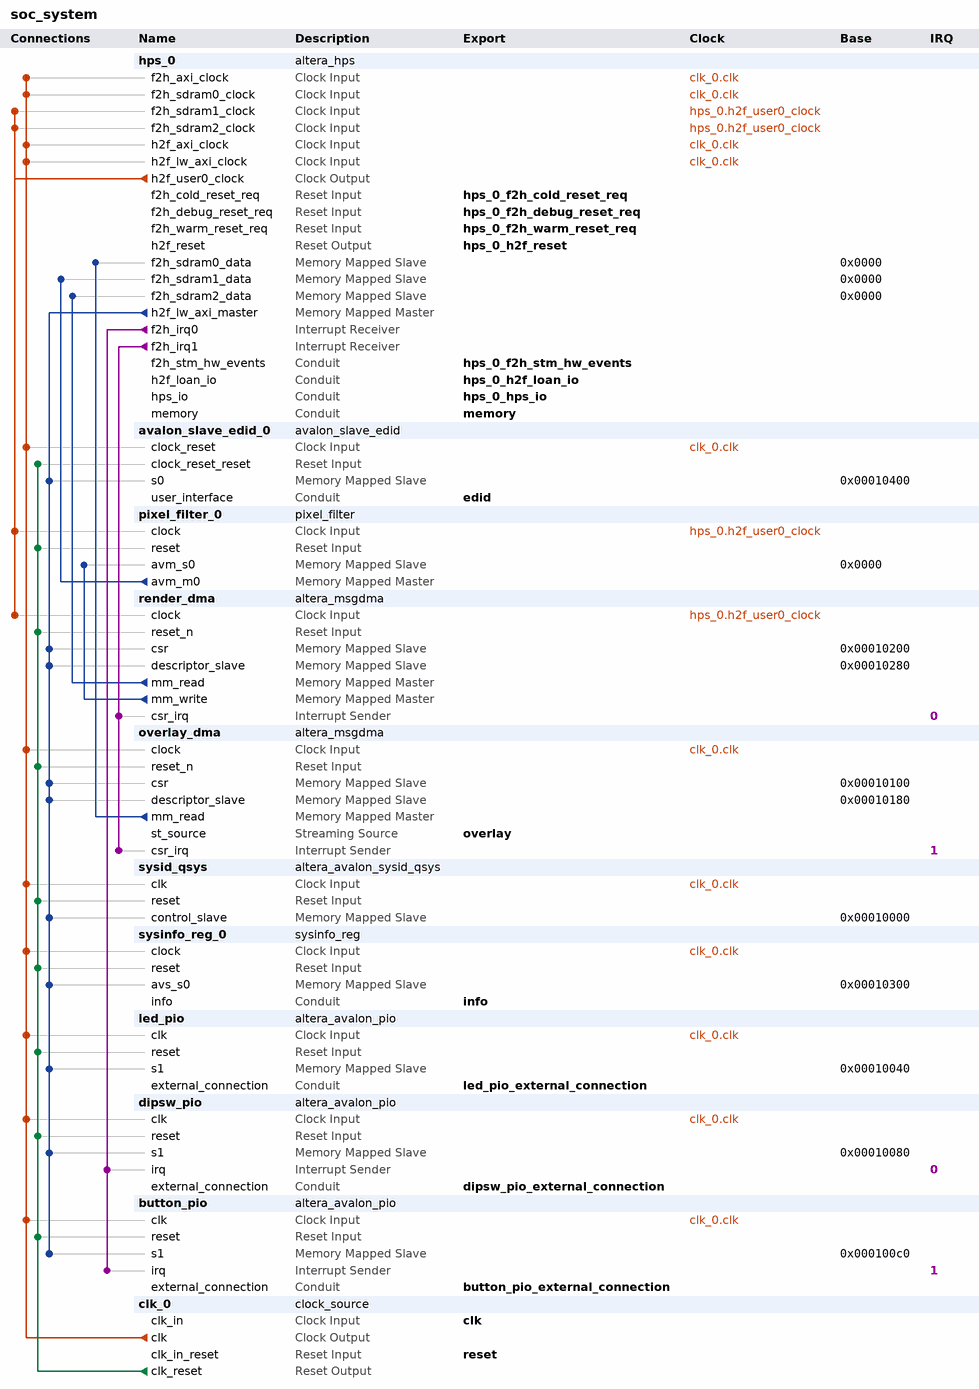
[diagram p0: system contents]
# Platform Designer (Qsys) system soc_system, Cyclone V 5CSEMA5F31C6
# Parameters at their usual value, and those the tool derives, are not listed.
package require -exact qsys 15.1
create_system soc_system
set_project_property DEVICE_FAMILY {Cyclone V}
set_project_property DEVICE 5CSEMA5F31C6

add_instance hps_0 altera_hps 15.1
set_instance_parameter_value hps_0 EMAC1_Mode RGMII
set_instance_parameter_value hps_0 EMAC1_PinMuxing {HPS I/O Set 0}
set_instance_parameter_value hps_0 F2SCLK_COLDRST_Enable true
set_instance_parameter_value hps_0 F2SCLK_DBGRST_Enable true
set_instance_parameter_value hps_0 F2SCLK_WARMRST_Enable true
set_instance_parameter_value hps_0 F2SDRAM_Type {Avalon-MM Read-Only,Avalon-MM Write-Only,Avalon-MM Read-Only}
set_instance_parameter_value hps_0 F2SDRAM_Width 64,64,64
set_instance_parameter_value hps_0 F2SINTERRUPT_Enable true
set_instance_parameter_value hps_0 F2S_Width 2
set_instance_parameter_value hps_0 FPGA_PERIPHERAL_OUTPUT_CLOCK_FREQ_EMAC0_GTX_CLK 100
set_instance_parameter_value hps_0 FPGA_PERIPHERAL_OUTPUT_CLOCK_FREQ_EMAC0_MD_CLK 100.0
set_instance_parameter_value hps_0 FPGA_PERIPHERAL_OUTPUT_CLOCK_FREQ_EMAC1_GTX_CLK 100
set_instance_parameter_value hps_0 FPGA_PERIPHERAL_OUTPUT_CLOCK_FREQ_EMAC1_MD_CLK 100.0
set_instance_parameter_value hps_0 HPS_PROTOCOL DDR3
set_instance_parameter_value hps_0 I2C0_Mode I2C
set_instance_parameter_value hps_0 I2C0_PinMuxing {HPS I/O Set 0}
set_instance_parameter_value hps_0 I2C1_Mode I2C
set_instance_parameter_value hps_0 I2C1_PinMuxing {HPS I/O Set 0}
set_instance_parameter_value hps_0 LWH2F_Enable true
set_instance_parameter_value hps_0 MEM_BANKADDR_WIDTH 3
set_instance_parameter_value hps_0 MEM_CLK_FREQ 400.0
set_instance_parameter_value hps_0 MEM_COL_ADDR_WIDTH 10
set_instance_parameter_value hps_0 MEM_DQ_WIDTH 32
set_instance_parameter_value hps_0 MEM_DRV_STR RZQ/6
set_instance_parameter_value hps_0 MEM_ROW_ADDR_WIDTH 15
set_instance_parameter_value hps_0 MEM_RTT_NOM RZQ/6
set_instance_parameter_value hps_0 MEM_RTT_WR {Dynamic ODT off}
set_instance_parameter_value hps_0 MEM_TCL 7
set_instance_parameter_value hps_0 MEM_TFAW_NS 45.0
set_instance_parameter_value hps_0 MEM_TRAS_NS 36.0
set_instance_parameter_value hps_0 MEM_TRCD_NS 13.125
set_instance_parameter_value hps_0 MEM_TRFC_NS 300.0
set_instance_parameter_value hps_0 MEM_TRP_NS 13.125
set_instance_parameter_value hps_0 MEM_VENDOR Micron
set_instance_parameter_value hps_0 MEM_WTCL 7
set_instance_parameter_value hps_0 QSPI_Mode {1 SS}
set_instance_parameter_value hps_0 QSPI_PinMuxing {HPS I/O Set 0}
set_instance_parameter_value hps_0 REF_CLK_FREQ 25.0
set_instance_parameter_value hps_0 S2FCLK_USER0CLK_Enable true
set_instance_parameter_value hps_0 S2FCLK_USER2CLK 1
set_instance_parameter_value hps_0 S2F_Width 3
set_instance_parameter_value hps_0 SDIO_Mode {4-bit Data}
set_instance_parameter_value hps_0 SDIO_PinMuxing {HPS I/O Set 0}
set_instance_parameter_value hps_0 SPIM1_Mode {Single Slave Select}
set_instance_parameter_value hps_0 SPIM1_PinMuxing {HPS I/O Set 0}
set_instance_parameter_value hps_0 STM_Enable true
set_instance_parameter_value hps_0 TIMING_BOARD_AC_SKEW 0.02
set_instance_parameter_value hps_0 TIMING_BOARD_AC_TO_CK_SKEW 0.01
set_instance_parameter_value hps_0 TIMING_BOARD_DQ_TO_DQS_SKEW 0.05
set_instance_parameter_value hps_0 TIMING_BOARD_MAX_CK_DELAY 0.03
set_instance_parameter_value hps_0 TIMING_BOARD_MAX_DQS_DELAY 0.02
set_instance_parameter_value hps_0 TIMING_BOARD_SKEW_BETWEEN_DQS 0.06
set_instance_parameter_value hps_0 TIMING_BOARD_SKEW_CKDQS_DIMM_MAX 0.12
set_instance_parameter_value hps_0 TIMING_BOARD_SKEW_CKDQS_DIMM_MIN 0.06
set_instance_parameter_value hps_0 TIMING_BOARD_SKEW_WITHIN_DQS 0.01
set_instance_parameter_value hps_0 TIMING_TDH 65
set_instance_parameter_value hps_0 TIMING_TDQSCK 255
set_instance_parameter_value hps_0 TIMING_TDQSQ 125
set_instance_parameter_value hps_0 TIMING_TDS 30
set_instance_parameter_value hps_0 TIMING_TIH 140
set_instance_parameter_value hps_0 TIMING_TIS 190
set_instance_parameter_value hps_0 TIMING_TQSH 0.4
set_instance_parameter_value hps_0 UART0_Mode {No Flow Control}
set_instance_parameter_value hps_0 UART0_PinMuxing {HPS I/O Set 0}
set_instance_parameter_value hps_0 USB1_Mode SDR
set_instance_parameter_value hps_0 USB1_PinMuxing {HPS I/O Set 0}
set_instance_parameter_value hps_0 desired_cfg_clk_mhz 100.0
set_instance_parameter_value hps_0 desired_qspi_clk_mhz 400.0
set_instance_parameter_value hps_0 use_default_mpu_clk false

add_instance avalon_slave_edid_0 avalon_slave_edid 1.1
set_instance_parameter_value avalon_slave_edid_0 DATA_WIDTH 8

add_instance pixel_filter_0 pixel_filter 1.0

add_instance render_dma altera_msgdma 15.1
set_instance_parameter_value render_dma BURST_ENABLE 1
set_instance_parameter_value render_dma DATA_FIFO_DEPTH 256
set_instance_parameter_value render_dma DATA_WIDTH 64
set_instance_parameter_value render_dma DESCRIPTOR_FIFO_DEPTH 1024
set_instance_parameter_value render_dma ENHANCED_FEATURES 0
set_instance_parameter_value render_dma ERROR_ENABLE 0
set_instance_parameter_value render_dma MAX_BURST_COUNT 64
set_instance_parameter_value render_dma MAX_BYTE 8388608
set_instance_parameter_value render_dma MODE 0
set_instance_parameter_value render_dma PACKET_ENABLE 0
set_instance_parameter_value render_dma TRANSFER_TYPE {Unaligned Accesses}

add_instance overlay_dma altera_msgdma 15.1
set_instance_parameter_value overlay_dma BURST_ENABLE 1
set_instance_parameter_value overlay_dma DATA_FIFO_DEPTH 4096
set_instance_parameter_value overlay_dma DATA_WIDTH 64
set_instance_parameter_value overlay_dma DESCRIPTOR_FIFO_DEPTH 8
set_instance_parameter_value overlay_dma ENHANCED_FEATURES 0
set_instance_parameter_value overlay_dma ERROR_ENABLE 0
set_instance_parameter_value overlay_dma MAX_BURST_COUNT 128
set_instance_parameter_value overlay_dma MAX_BYTE 8388608
set_instance_parameter_value overlay_dma MODE 1
set_instance_parameter_value overlay_dma PACKET_ENABLE 0
set_instance_parameter_value overlay_dma TRANSFER_TYPE {Full Word Accesses Only}

add_instance sysid_qsys altera_avalon_sysid_qsys 15.1
set_instance_parameter_value sysid_qsys id -1395322110

add_instance sysinfo_reg_0 sysinfo_reg 1.0

add_instance led_pio altera_avalon_pio 15.1
set_instance_parameter_value led_pio direction Output
set_instance_parameter_value led_pio resetValue 15
set_instance_parameter_value led_pio width 10

add_instance dipsw_pio altera_avalon_pio 15.1
set_instance_parameter_value dipsw_pio bitClearingEdgeCapReg true
set_instance_parameter_value dipsw_pio captureEdge true
set_instance_parameter_value dipsw_pio direction Input
set_instance_parameter_value dipsw_pio edgeType ANY
set_instance_parameter_value dipsw_pio generateIRQ true
set_instance_parameter_value dipsw_pio irqType EDGE
set_instance_parameter_value dipsw_pio width 10

add_instance button_pio altera_avalon_pio 15.1
set_instance_parameter_value button_pio bitClearingEdgeCapReg true
set_instance_parameter_value button_pio captureEdge true
set_instance_parameter_value button_pio direction Input
set_instance_parameter_value button_pio edgeType FALLING
set_instance_parameter_value button_pio generateIRQ true
set_instance_parameter_value button_pio irqType EDGE
set_instance_parameter_value button_pio width 4

add_instance clk_0 clock_source 15.1
set_instance_parameter_value clk_0 clockFrequency 50000000

# connections
add_connection clk_0.clk avalon_slave_edid_0.clock_reset clock
add_connection clk_0.clk button_pio.clk clock
add_connection clk_0.clk dipsw_pio.clk clock
add_connection clk_0.clk hps_0.f2h_axi_clock clock
add_connection clk_0.clk hps_0.f2h_sdram0_clock clock
add_connection clk_0.clk hps_0.h2f_axi_clock clock
add_connection clk_0.clk hps_0.h2f_lw_axi_clock clock
add_connection clk_0.clk led_pio.clk clock
add_connection clk_0.clk overlay_dma.clock clock
add_connection clk_0.clk sysid_qsys.clk clock
add_connection clk_0.clk sysinfo_reg_0.clock clock
add_connection hps_0.h2f_user0_clock hps_0.f2h_sdram1_clock clock
add_connection hps_0.h2f_user0_clock hps_0.f2h_sdram2_clock clock
add_connection hps_0.h2f_user0_clock pixel_filter_0.clock clock
add_connection hps_0.h2f_user0_clock render_dma.clock clock
add_connection clk_0.clk_reset avalon_slave_edid_0.clock_reset_reset reset
add_connection clk_0.clk_reset button_pio.reset reset
add_connection clk_0.clk_reset dipsw_pio.reset reset
add_connection clk_0.clk_reset led_pio.reset reset
add_connection clk_0.clk_reset overlay_dma.reset_n reset
add_connection clk_0.clk_reset pixel_filter_0.reset reset
add_connection clk_0.clk_reset render_dma.reset_n reset
add_connection clk_0.clk_reset sysid_qsys.reset reset
add_connection clk_0.clk_reset sysinfo_reg_0.reset reset
add_connection hps_0.h2f_lw_axi_master avalon_slave_edid_0.s0 avalon
set_connection_parameter_value hps_0.h2f_lw_axi_master/avalon_slave_edid_0.s0 baseAddress 0x00010400
add_connection hps_0.h2f_lw_axi_master button_pio.s1 avalon
set_connection_parameter_value hps_0.h2f_lw_axi_master/button_pio.s1 baseAddress 0x000100c0
add_connection hps_0.h2f_lw_axi_master dipsw_pio.s1 avalon
set_connection_parameter_value hps_0.h2f_lw_axi_master/dipsw_pio.s1 baseAddress 0x00010080
add_connection hps_0.h2f_lw_axi_master led_pio.s1 avalon
set_connection_parameter_value hps_0.h2f_lw_axi_master/led_pio.s1 baseAddress 0x00010040
add_connection hps_0.h2f_lw_axi_master overlay_dma.csr avalon
set_connection_parameter_value hps_0.h2f_lw_axi_master/overlay_dma.csr baseAddress 0x00010100
add_connection hps_0.h2f_lw_axi_master overlay_dma.descriptor_slave avalon
set_connection_parameter_value hps_0.h2f_lw_axi_master/overlay_dma.descriptor_slave baseAddress 0x00010180
add_connection hps_0.h2f_lw_axi_master render_dma.csr avalon
set_connection_parameter_value hps_0.h2f_lw_axi_master/render_dma.csr baseAddress 0x00010200
add_connection hps_0.h2f_lw_axi_master render_dma.descriptor_slave avalon
set_connection_parameter_value hps_0.h2f_lw_axi_master/render_dma.descriptor_slave baseAddress 0x00010280
add_connection hps_0.h2f_lw_axi_master sysid_qsys.control_slave avalon
set_connection_parameter_value hps_0.h2f_lw_axi_master/sysid_qsys.control_slave baseAddress 0x00010000
add_connection hps_0.h2f_lw_axi_master sysinfo_reg_0.avs_s0 avalon
set_connection_parameter_value hps_0.h2f_lw_axi_master/sysinfo_reg_0.avs_s0 baseAddress 0x00010300
add_connection overlay_dma.mm_read hps_0.f2h_sdram0_data avalon
set_connection_parameter_value overlay_dma.mm_read/hps_0.f2h_sdram0_data baseAddress 0x0000
add_connection pixel_filter_0.avm_m0 hps_0.f2h_sdram1_data avalon
set_connection_parameter_value pixel_filter_0.avm_m0/hps_0.f2h_sdram1_data baseAddress 0x0000
add_connection render_dma.mm_read hps_0.f2h_sdram2_data avalon
set_connection_parameter_value render_dma.mm_read/hps_0.f2h_sdram2_data baseAddress 0x0000
add_connection render_dma.mm_write pixel_filter_0.avm_s0 avalon
set_connection_parameter_value render_dma.mm_write/pixel_filter_0.avm_s0 baseAddress 0x0000
add_connection hps_0.f2h_irq0 button_pio.irq interrupt
set_connection_parameter_value hps_0.f2h_irq0/button_pio.irq irqNumber 1
add_connection hps_0.f2h_irq0 dipsw_pio.irq interrupt
set_connection_parameter_value hps_0.f2h_irq0/dipsw_pio.irq irqNumber 0
add_connection hps_0.f2h_irq1 overlay_dma.csr_irq interrupt
set_connection_parameter_value hps_0.f2h_irq1/overlay_dma.csr_irq irqNumber 1
add_connection hps_0.f2h_irq1 render_dma.csr_irq interrupt
set_connection_parameter_value hps_0.f2h_irq1/render_dma.csr_irq irqNumber 0

# exported interfaces
add_interface button_pio_external_connection conduit end
set_interface_property button_pio_external_connection EXPORT_OF button_pio.external_connection
add_interface clk clock sink
set_interface_property clk EXPORT_OF clk_0.clk_in
add_interface dipsw_pio_external_connection conduit end
set_interface_property dipsw_pio_external_connection EXPORT_OF dipsw_pio.external_connection
add_interface edid conduit end
set_interface_property edid EXPORT_OF avalon_slave_edid_0.user_interface
add_interface hps_0_f2h_cold_reset_req reset sink
set_interface_property hps_0_f2h_cold_reset_req EXPORT_OF hps_0.f2h_cold_reset_req
add_interface hps_0_f2h_debug_reset_req reset sink
set_interface_property hps_0_f2h_debug_reset_req EXPORT_OF hps_0.f2h_debug_reset_req
add_interface hps_0_f2h_stm_hw_events conduit end
set_interface_property hps_0_f2h_stm_hw_events EXPORT_OF hps_0.f2h_stm_hw_events
add_interface hps_0_f2h_warm_reset_req reset sink
set_interface_property hps_0_f2h_warm_reset_req EXPORT_OF hps_0.f2h_warm_reset_req
add_interface hps_0_h2f_loan_io conduit end
set_interface_property hps_0_h2f_loan_io EXPORT_OF hps_0.h2f_loan_io
add_interface hps_0_h2f_reset reset source
set_interface_property hps_0_h2f_reset EXPORT_OF hps_0.h2f_reset
add_interface hps_0_hps_io conduit end
set_interface_property hps_0_hps_io EXPORT_OF hps_0.hps_io
add_interface info conduit end
set_interface_property info EXPORT_OF sysinfo_reg_0.info
add_interface led_pio_external_connection conduit end
set_interface_property led_pio_external_connection EXPORT_OF led_pio.external_connection
add_interface memory conduit end
set_interface_property memory EXPORT_OF hps_0.memory
add_interface overlay avalon_streaming source
set_interface_property overlay EXPORT_OF overlay_dma.st_source
add_interface reset reset sink
set_interface_property reset EXPORT_OF clk_0.clk_in_reset

set_interconnect_requirement {$system} qsys_mm.clockCrossingAdapter HANDSHAKE
set_interconnect_requirement {$system} qsys_mm.maxAdditionalLatency 1

save_system soc_system.qsys
